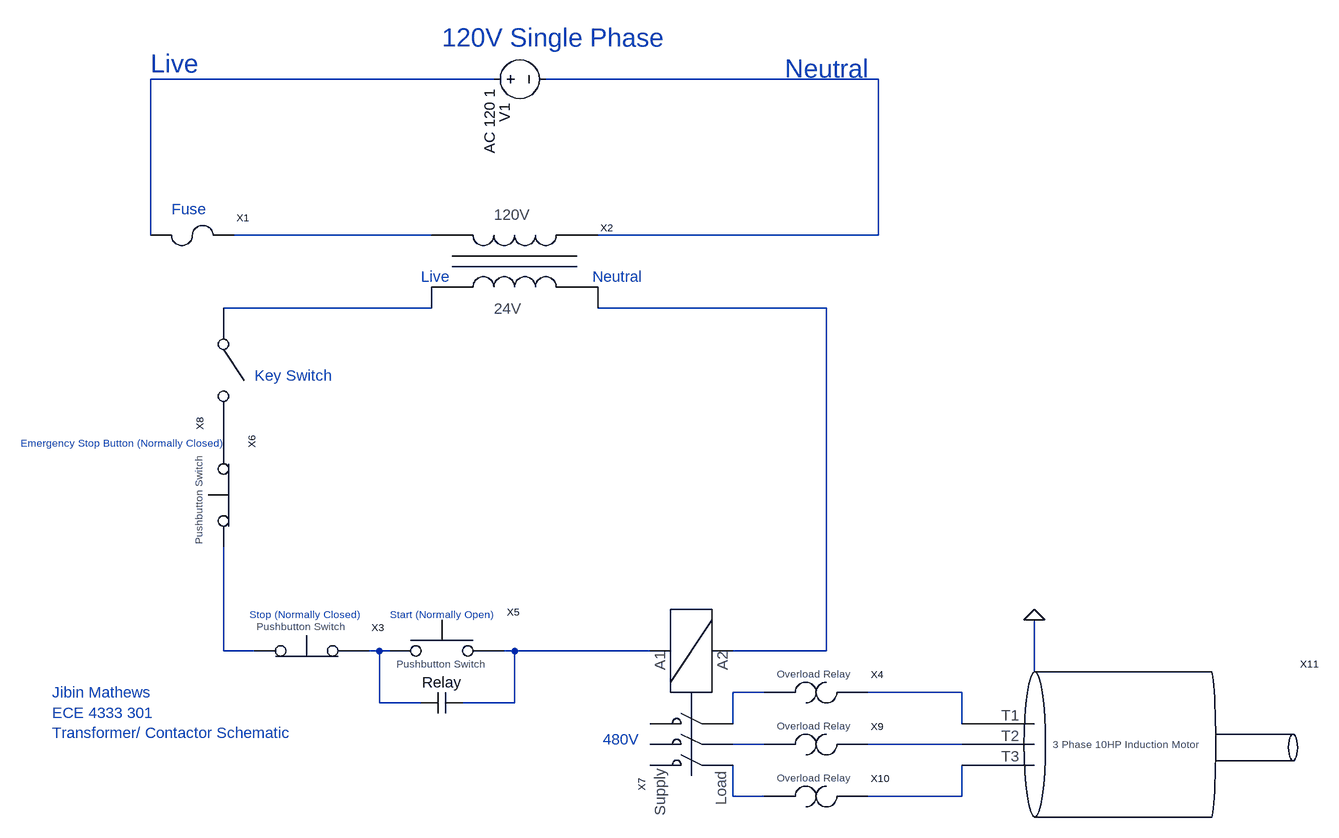
[diagram p0: schematic Test.asc]
Test.asc, the LTspice schematic file:
Version 4
SHEET 1 1604 680
WIRE 368 -944 -160 -944
WIRE 960 -944 448 -944
WIRE -160 -704 -160 -944
WIRE 272 -704 -32 -704
WIRE 960 -704 960 -944
WIRE 960 -704 528 -704
WIRE 272 -592 -48 -592
WIRE 880 -592 528 -592
WIRE -48 -64 -48 -224
WIRE 0 -64 -48 -64
WIRE 192 -64 176 -64
WIRE 208 -64 192 -64
WIRE 400 -64 384 -64
WIRE 608 -64 400 -64
WIRE 880 -64 880 -592
WIRE 880 -64 736 -64
WIRE 1200 -32 1200 -112
WIRE 784 0 736 0
WIRE 1088 0 944 0
WIRE 192 16 192 -64
WIRE 256 16 192 16
WIRE 400 16 400 -64
WIRE 400 16 320 16
WIRE 736 48 736 0
WIRE 1088 48 1088 0
WIRE 784 80 736 80
WIRE 1088 80 944 80
WIRE 736 160 736 112
WIRE 784 160 736 160
WIRE 1088 160 1088 112
WIRE 1088 160 944 160
FLAG 1200 -112 0
SYMBOL voltage 352 -944 R270
WINDOW 0 -66 33 Left 2
WINDOW 123 -115 10 Left 2
WINDOW 39 0 0 Left 0
SYMATTR InstName V1
SYMATTR Value2 AC 120 1
SYMATTR Value ""
SYMBOL Fuse\\Fuse1 -80 -704 R0
SYMATTR InstName X1
SYMBOL Transformer\\120to24V 288 -704 R0
SYMATTR InstName X2
SYMBOL Switch -48 -592 R90
SYMATTR InstName X6
SYMBOL Lab4Components\\PushButton\ Stop -48 -224 R270
SYMATTR InstName X8
SYMBOL Lab4Components\\Contactor_Mag 672 -64 M90
SYMATTR InstName X7
SYMBOL Lab4Components\\Overload\ Relay 784 0 R0
SYMATTR InstName X4
SYMBOL Lab4Components\\Overload\ Relay 784 80 R0
SYMATTR InstName X9
SYMBOL Lab4Components\\Overload\ Relay 784 160 R0
SYMATTR InstName X10
SYMBOL Lab4Components\\Motor_Large 1216 80 R0
SYMATTR InstName X11
SYMBOL Lab4Components\\PushButton\ Stop 0 -64 R0
SYMATTR InstName X3
SYMBOL Lab4Components\\PushButton\ Start 208 -64 R0
SYMATTR InstName X5
SYMBOL cap 320 0 R90
WINDOW 0 0 32 VBottom 2
WINDOW 3 32 32 VTop 2
SYMATTR InstName Relay
SYMATTR Value ""
TEXT -160 -968 Left 4 ;Live
TEXT 816 -960 Left 4 ;Neutral
TEXT 288 -1008 Left 4 ;120V Single Phase
TEXT 256 -640 Left 2 ;Live
TEXT 208 -120 Left 1 ;Start (Normally Open)
TEXT -8 -120 Left 1 ;Stop (Normally Closed)
TEXT 0 -488 Left 2 ;Key Switch
TEXT -360 -384 Left 1 ;Emergency Stop Button (Normally Closed)
TEXT 520 -640 Left 2 ;Neutral
TEXT 536 72 Left 2 ;480V
TEXT -128 -744 Left 2 ;Fuse
TEXT -312 0 Left 2 ;Jibin Mathews\nECE 4333 301\nTransformer/ Contactor Schematic

The netlist it stands for:
* Test.asc
V1 N001 N002 AC 120 1
XX1 Fuse1
XX2 120to24V
XX6 Switch
XX8 PushButton Stop
XX7 Contactor_Mag
XX4 Overload Relay
XX9 Overload Relay
XX10 Overload Relay
XX11 Motor_Large
XX3 PushButton Stop
XX5 PushButton Start
C§Relay N008 N007
* Live
* Neutral
* 120V Single Phase
* Live
* Start (Normally Open)
* Stop (Normally Closed)
* Key Switch
* Emergency Stop Button (Normally Closed)
* Neutral
* 480V
* Fuse
* Jibin Mathews
* ECE 4333 301
* Transformer/ Contactor Schematic
.backanno
.end